# Altium schematic sheet Sheet1.SchDoc
size A4
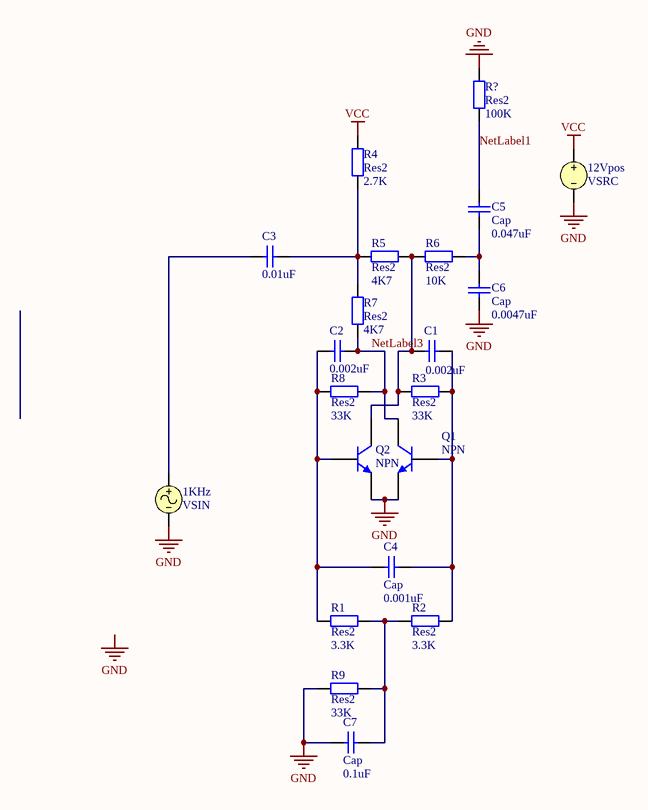
[diagram p0: Sheet1.SchDoc]

## Parts
1KHz  VSIN
12Vpos  VSRC
C1  value 0.002uF  [RAD-0.3]  (hidden comment: Cap)
C2  value 0.002uF  [RAD-0.3]  (hidden comment: Cap)
C3  value 0.01uF  [RAD-0.3]  (hidden comment: Cap)
C4  Cap  value 0.001uF  [RAD-0.3]
C5  Cap  value 0.047uF  [RAD-0.3]
C6  Cap  value 0.0047uF  [RAD-0.3]
C7  Cap  value 0.1uF  [RAD-0.3]
Q1  NPN  [TO-226]
Q2  NPN  [TO-226]
R1  Res2  value 3.3K  [AXIAL-0.4]
R2  Res2  value 3.3K  [AXIAL-0.4]
R3  Res2  value 33K  [AXIAL-0.4]
R4  Res2  value 2.7K  [AXIAL-0.4]
R5  Res2  value 4K7  [AXIAL-0.4]
R6  Res2  value 10K  [AXIAL-0.4]
R7  Res2  value 4K7  [AXIAL-0.4]
R8  Res2  value 33K  [AXIAL-0.4]
R9  Res2  value 33K  [AXIAL-0.4]
R?  Res2  value 100K  [AXIAL-0.4]

## Nets
GND: 1KHz.2 12Vpos.2 C6.1 C7.1 Q1.3(E) Q2.3(E) R9.1 R?.2
VCC: 12Vpos.1 R4.2
NetLabel1: C5.2 R?.1
NetLabel3: C2.2 Q1.1(C) R7.1 R8.1
Net1KHz_1: 1KHz.1 C3.1
NetC1_1: C1.1 C4.1 Q1.2(B) R2.2 R3.1
NetC1_2: C1.2 Q2.1(C) R3.2 R5.1 R6.1
NetC2_1: C2.1 C4.2 Q2.2(B) R1.2 R8.2
NetC3_2: C3.2 R4.1 R5.2 R7.2
NetC5_1: C5.1 C6.2 R6.2
NetC7_2: C7.2 R1.1 R2.1 R9.2

## Notes on the sheet
- Labels drawn without touching a wire or pin: GND

## Library data of the parts
1KHz = VSIN: Sinusoidal Voltage Source; Note: PCB Footprint - Not required; Published: 8-Jun-2000; LatestRevisionDate: 15-Nov-2004; LatestRevisionNote: Corrected Netlist.; PackageReference: Not Applicable; Publisher: Altium Limited
12Vpos = VSRC: Voltage Source; Note: PCB Footprint - Not required; Value: +12; Published: 8-Jun-2000; LatestRevisionDate: 17-Jul-2002; LatestRevisionNote: Re-released for DXP Platform.; PackageReference: Not Applicable; Publisher: Altium Limited
C1-C7 = Cap: Capacitor; Published: 8-Jun-2000; LatestRevisionDate: 17-Jul-2002; LatestRevisionNote: Re-released for DXP Platform.; PackageReference: RAD-0.3; Publisher: Altium Limited
Q1 Q2 = NPN: NPN Bipolar Transistor; Published: 8-Jun-2000; LatestRevisionDate: 17-Jul-2002; LatestRevisionNote: Re-released for DXP Platform.; PackageReference: TO-226; Publisher: Altium Limited; Code_JEDEC: TO-226-AA
R1-R9 R? = Res2: Resistor; Published: 8-Jun-2000; LatestRevisionDate: 17-Jul-2002; LatestRevisionNote: Re-released for DXP Platform.; PackageReference: AXIAL-0.4; Publisher: Altium Limited